# EAGLE design untitled (EAGLE 6.6.0)
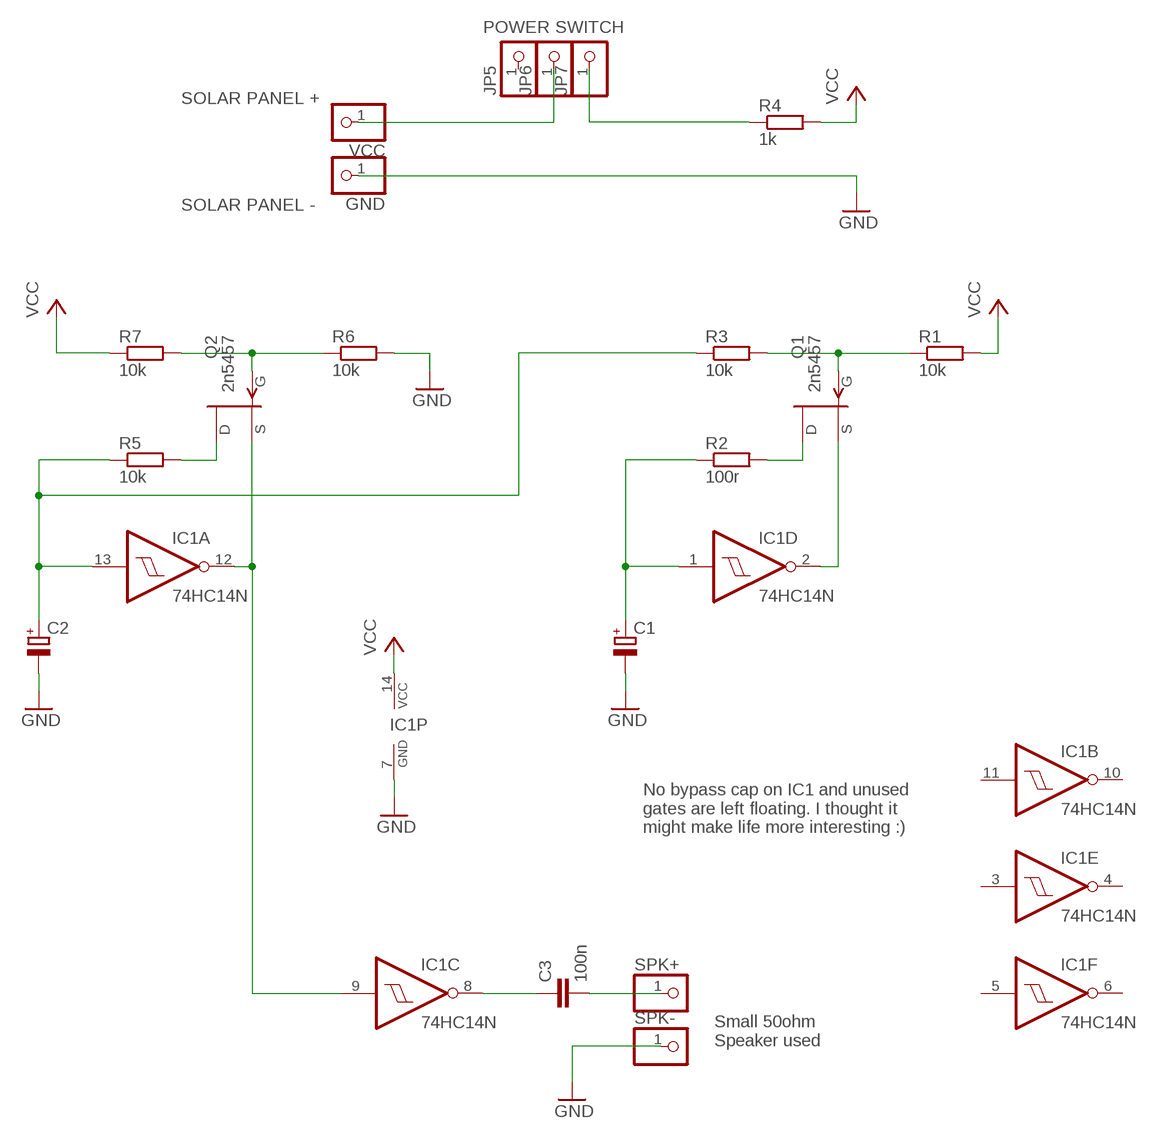
[diagram p0: schematic, sheet 1]

## Parts
C1  CPOL-EUE2.5-5  [E2,5-5]
C2  CPOL-EUE2.5-5  [E2,5-5]
C3  100n  C-EU025-025X050  [C025-025X050]
GND  PINHD-1X1  [1X01]
IC1  74HC14N  [DIL14]
JP5  PINHD-1X1  [1X01]
JP6  PINHD-1X1  [1X01]
JP7  PINHD-1X1  [1X01]
Q1  2n5457  2N5484  [TO92-]
Q2  2n5457  2N5484  [TO92-]
R1  10k  R-EU_0207/10  [0207/10]
R2  100r  R-EU_0207/10  [0207/10]
R3  10k  R-EU_0207/10  [0207/10]
R4  1k  R-EU_0207/10  [0207/10]
R5  10k  R-EU_0207/10  [0207/10]
R6  10k  R-EU_0207/10  [0207/10]
R7  10k  R-EU_0207/10  [0207/10]
SPK+  PINHD-1X1  [1X01]
SPK-  PINHD-1X1  [1X01]
VCC  PINHD-1X1  [1X01]

## Nets
GND: C1.- C2.- GND.1 IC1.7(P:GND) R6.2 SPK-.1
N$1: C2.+ IC1.13(A:I) R3.1 R5.1
N$2: JP6.1 VCC.1
N$3: Q2.3(D) R5.2
N$4: IC1.9(C:I) IC1.12(A:O) Q2.2(S)
N$5: Q2.1(G) R6.1 R7.2
N$6: C1.+ IC1.1(D:I) R2.1
N$7: Q1.3(D) R2.2
N$8: IC1.2(D:O) Q1.2(S)
N$9: Q1.1(G) R1.1 R3.2
N$10: JP7.1 R4.1
N$11: C3.1 IC1.8(C:O)
SPK: C3.2 SPK+.1
VCC: IC1.14(P:VCC) R1.2 R4.2 R7.1
Unconnected: IC1.3(E:I) IC1.4(E:O) IC1.5(F:I) IC1.6(F:O) IC1.10(B:O) IC1.11(B:I) JP5.1

## Notes on the sheet
- POWER SWITCH
- SOLAR PANEL +
- SOLAR PANEL -
- No bypass cap on IC1 and unused
  gates are left floating. I thought it
  might make life more interesting :)
- Small 50ohm
  Speaker used

## Library data of the parts
C1 C2 = rcl:CPOL-EU: POLARIZED CAPACITOR, European symbol
C3 = rcl:C-EU: CAPACITOR, European symbol
GND JP5-JP7 SPK+ SPK- VCC = pinhead:PINHD-1X1: PIN HEADER
IC1 = 74xx-eu:74*14: Hex schmitt trigger INVERTER
Q1 Q2 = transistor-fet:?548*: N-Channel JFETs Source: VISHAY 2N5484.pdf Compatible: TO92 2N5245 J304 J305 U310 J308 J309 J310 TO72 2N4416 2N4416A 2N3823 2N4351 3N169 3N170 3N171 MFE3002 TO18 2N3796 2N3797 MFE825 Source: Motorola European Master Guide Pacge 3-59
R1-R7 = resistor:R-EU_: RESISTOR, European symbol

## Board
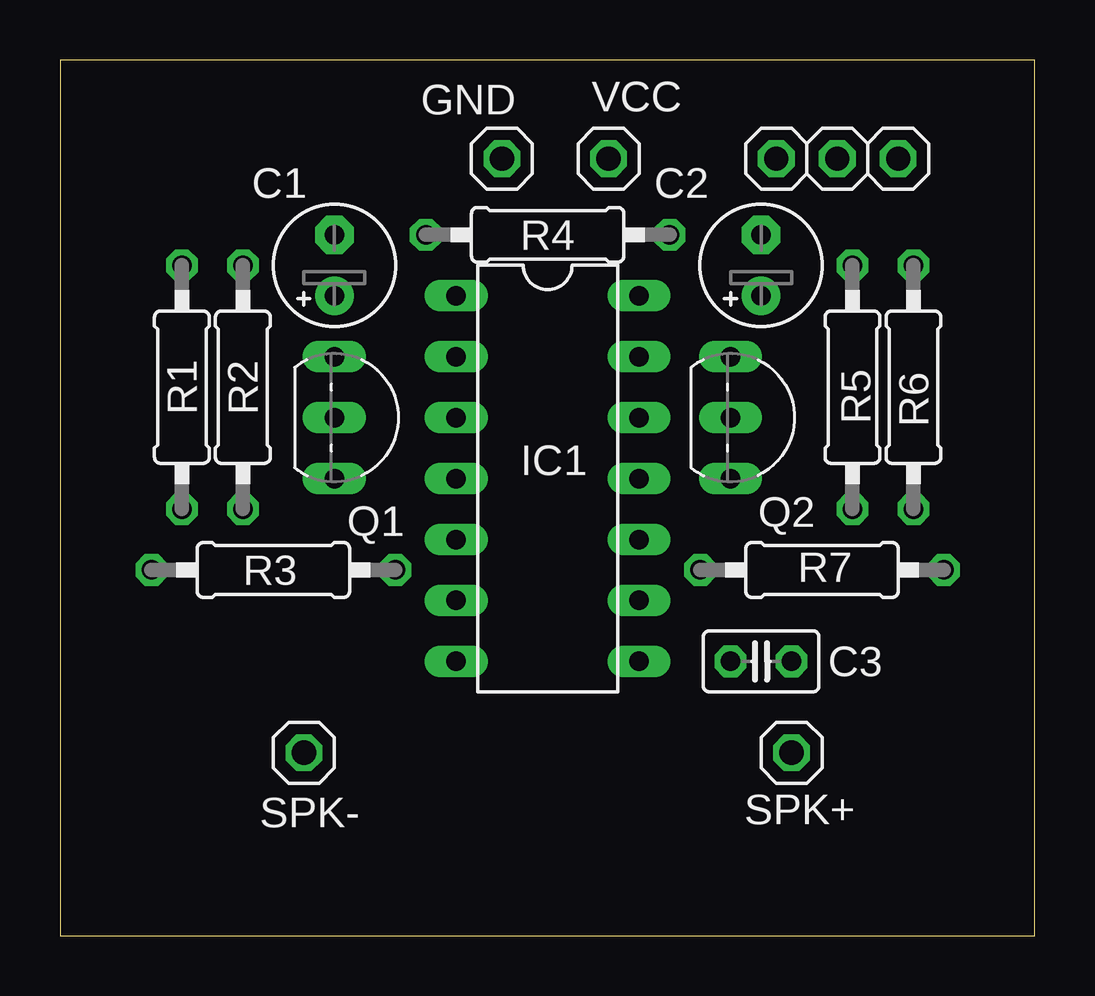
[diagram p1: board, top side]
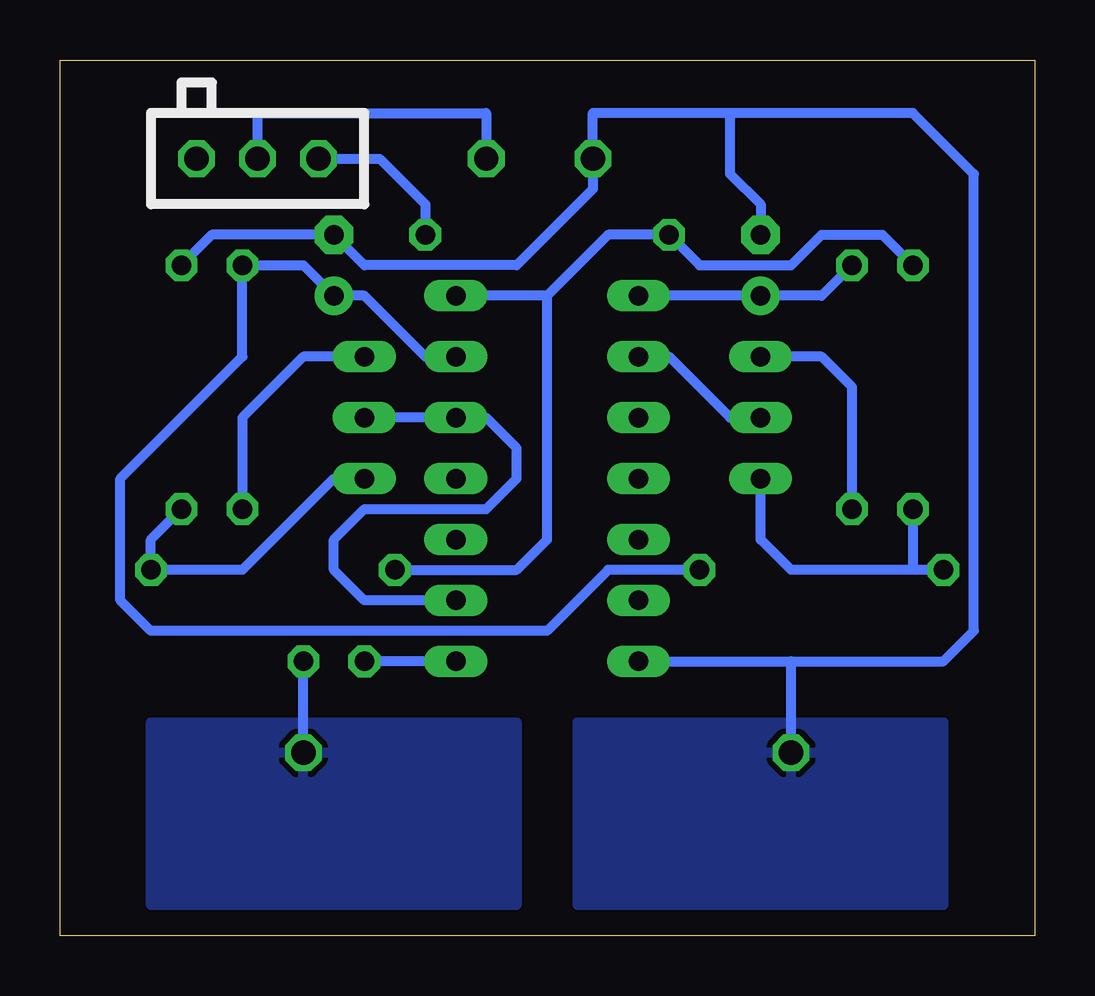
[diagram p2: board, bottom side, seen from below]

Size 40.62 x 36.5 mm. Coordinates in mm from the lower left corner, seen from the top.
Outline: 0,0 40.62,0 40.62,36.5 0,36.5 0,0
Copper layers (1*16): Top 0.035mm / dielectric 1.5mm / Bottom 0.035mm
Design rules "default": minimum track width 10mil, minimum drill 24mil, track to track 8mil, track to pad 8mil, pad to pad 8mil, via to via 8mil, smd to smd 8mil, copper to edge 40mil, drill to drill 8mil, minimum pad ring 10mil, minimum via ring 8mil, stop-mask expansion 4mil, vias tented up to drill 0mil, thermal gap 10mil

### Footprints (pad centres in the part's own frame; a part is rotated, then mirrored left to right if it is on the bottom)
E2,5-5 = drill 0.813 pad 1.6: + -1.27,0 | drill 0.813 pad 1.6 octagon: - 1.27,0
C025-025X050 = drill 0.813 octagon: 1 -1.27,0; 2 1.27,0
1X01 = drill 1.016 octagon: 1 0,0
DIL14 = drill 0.813 long: 1 -7.62,-3.81; 2 -5.08,-3.81; 3 -2.54,-3.81; 4 0,-3.81; 5 2.54,-3.81; 6 5.08,-3.81; 7 7.62,-3.81; 8 7.62,3.81; 9 5.08,3.81; 10 2.54,3.81; 11 0,3.81; 12 -2.54,3.81; 13 -5.08,3.81; 14 -7.62,3.81
TO92- = drill 0.813 long: 1 2.54,0; 2 0,0; 3 -2.54,0
0207/10 = drill 0.813 octagon: 1 -5.08,0; 2 5.08,0

### Placement (x,y rotation side)
C1  11.43,27.94 90 top
C2  29.21,27.94 90 top
C3  29.21,11.43 0 top
GND  18.41,32.39 0 top
IC1  20.32,19.05 270 top
JP5  34.92,32.39 0 top
JP6  32.39,32.39 0 top
JP7  29.84,32.39 0 top
Q1  11.43,21.59 270 top
Q2  27.94,21.59 270 top
R1  5.08,22.86 90 top
R2  7.62,22.86 270 top
R3  8.89,15.24 180 top
R4  20.32,29.21 180 top
R5  33.02,22.86 270 top
R6  35.56,22.86 90 top
R7  31.75,15.24 0 top
SPK+  30.48,7.62 0 top
SPK-  10.16,7.62 0 top
VCC  22.86,32.39 0 top

### Tracks (layer width: path | path; a pad name or v marks a point on that pad's centre or on a via)
GND
  Bottom 0.406: C1.- 11.43,30.48 12.7,31.75 12.7,34.29 | IC1.7 10.16,11.43 | 10.16,11.43 3.81,11.43 2.54,12.7 2.54,31.75 5.08,34.29 12.7,34.29 | 12.7,34.29 18.41,34.29 GND.1 18.41,31.11 21.59,27.94 27.94,27.94 C2.- 34.29,29.21 R6.2 | SPK-.1 10.16,11.43
  pour Bottom: 3.81,8.89 3.81,1.27 19.05,1.27 19.05,8.89
N$1
  Bottom 0.406: IC1.13 25.4,24.13 27.94,26.67 C2.+ 30.48,27.94 R5.1 33.02,24.13 38.1,19.05 38.1,13.97 36.83,12.7 20.32,12.7 17.78,15.24 R3.1
N$2
  Bottom 0.406: JP6.1 32.39,34.29 22.86,34.29 VCC.1
N$3
  Bottom 0.406: Q2.3 30.48,24.13 33.02,21.59 R5.2
N$4
  Bottom 0.406: Q2.2 IC1.12 22.86,21.59 21.59,20.32 21.59,19.05 22.86,17.78 27.94,17.78 29.21,16.51 29.21,15.24 27.94,13.97 IC1.9
N$5
  Bottom 0.406: R6.1 36.83,16.51 R7.2 33.02,15.24 29.21,19.05 Q2.1
N$6
  Bottom 0.406: R2.1 8.89,26.67 C1.+ IC1.1
N$7
  Bottom 0.406: R2.2 7.62,22.86 8.89,24.13 Q1.3
N$8
  Bottom 0.406: Q1.2 12.7,21.59 15.24,24.13 IC1.2
N$9
  Bottom 0.406: R3.2 5.08,15.24 | 5.08,15.24 10.16,15.24 11.43,16.51 Q1.1 | R1.1 5.08,15.24
N$10
  Bottom 0.406: JP7.1 27.3,32.39 25.4,30.48 R4.1
N$11
  Bottom 0.406: IC1.8 C3.1
SPK
  Bottom 0.406: SPK+.1 C3.2
  pour Bottom: 21.59,8.89 21.59,1.27 36.83,1.27 36.83,8.89
VCC
  Bottom 0.406: R1.2 6.35,29.21 8.89,29.21 10.16,27.94 13.97,27.94 R4.2 17.78,29.21 20.32,26.67 | 20.32,26.67 IC1.14 | R7.1 21.59,15.24 20.32,16.51 20.32,26.67